# EAGLE design JST_Breakout (EAGLE 9.3.0)
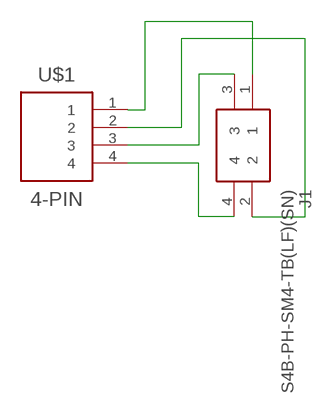
[diagram p0: schematic, sheet 1]

## Parts
J1  S4B-PH-SM4-TB(LF)(SN)  [S4B-PH-SM4-TB]
U$1  4-PIN  [1X04]

## Nets
N$1: J1.1 U$1.1
N$2: J1.2 U$1.2
N$3: J1.3 U$1.3
N$4: J1.4 U$1.4

## Library data of the parts
J1 = APU_ENGR480_UPS_EAGLE_Library:S4B-PH-SM4-TB(LF)(SN): PH SMT side entry shroud header 4 way JST PH Series, 2mm Pitch 4 Way 1 Row Right Angle PCB Header, Solder Termination, 2A Source: Datasheet <http://uk.rs-online.com/web/p/products/6881366>; DESCRIPTION: PH SMT side entry shroud header 4 way JST PH Series, 2mm Pitch 4 Way 1 Row Right Angle PCB Header, Solder Termination, 2A; HEIGHT: mm; MANUFACTURER_NAME: JST (JAPAN SOLDERLESS TERMINALS); MANUFACTURER_PART_NUMBER: S4B-PH-SM4-TB(LF)(SN); RS_PART_NUMBER: 6881366P; RS_PRICE-STOCK: http://uk.rs-online.com/web/p/products/6881366P
U$1 = APU_ENGR480_UPS_EAGLE_Library:4-PIN

## Board
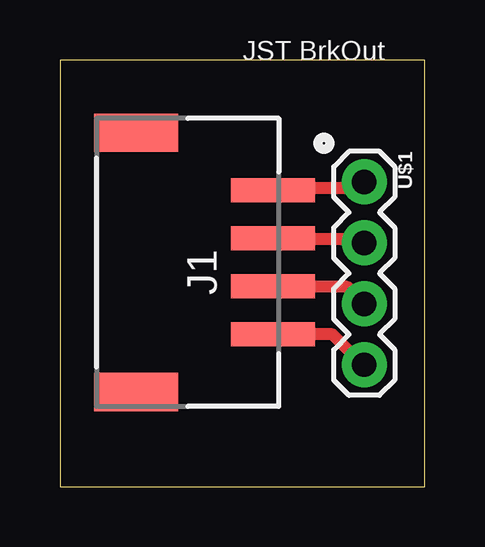
[diagram p1: board, top side]

Size 15.22 x 17.78 mm. Coordinates in mm from the lower left corner, seen from the top.
Outline: 0,0 15.22,0 15.22,17.78 0,17.78 0,0
Copper layers (1*16): Top 0.035mm / dielectric 1.5mm / Bottom 0.035mm
Design rules "default": minimum track width 6mil, minimum drill 0.35mm, track to track 6mil, track to pad 6mil, pad to pad 6mil, via to via 6mil, smd to smd 6mil, copper to edge 40mil, drill to drill 6mil, minimum pad ring 10mil, minimum via ring 8mil, stop-mask expansion 4mil, vias tented up to drill 0mil, thermal gap 10mil

### Footprints (pad centres in the part's own frame; a part is rotated, then mirrored left to right if it is on the bottom)
S4B-PH-SM4-TB = smd 1 x 3.5: 1 6,0; 2 4,0; 3 2,0; 4 0,0 | smd 1.6 x 3.5: 5 -2.4,5.7; 6 8.4,5.7
1X04 = drill 1.016 pad 1.88: 1 0,0; 2 2.54,0; 3 5.08,0; 4 7.62,0

### Placement (x,y rotation side)
J1  8.88,6.35 90 top
U$1  12.69,12.7 270 top

### Tracks (layer width: path | path; a pad name or v marks a point on that pad's centre or on a via)
N$1
  Top 0.152: 8.93,12.45 J1.1
  Top 0.508: 8.93,12.45 12.44,12.45 U$1.1
N$2
  Top 0.152: 8.93,10.31 J1.2
  Top 0.508: 8.93,10.31 12.44,10.31 12.59,10.16 U$1.2
N$3
  Top 0.152: 8.93,8.33 J1.3
  Top 0.508: 8.93,8.33 11.98,8.33 U$1.3
N$4
  Top 0.508: J1.4 11.37,6.35 12.59,5.13 U$1.4

### Text on the board
tPlace: JST BrkOut